# EAGLE design Circuit Diagram (EAGLE 9.3.0)
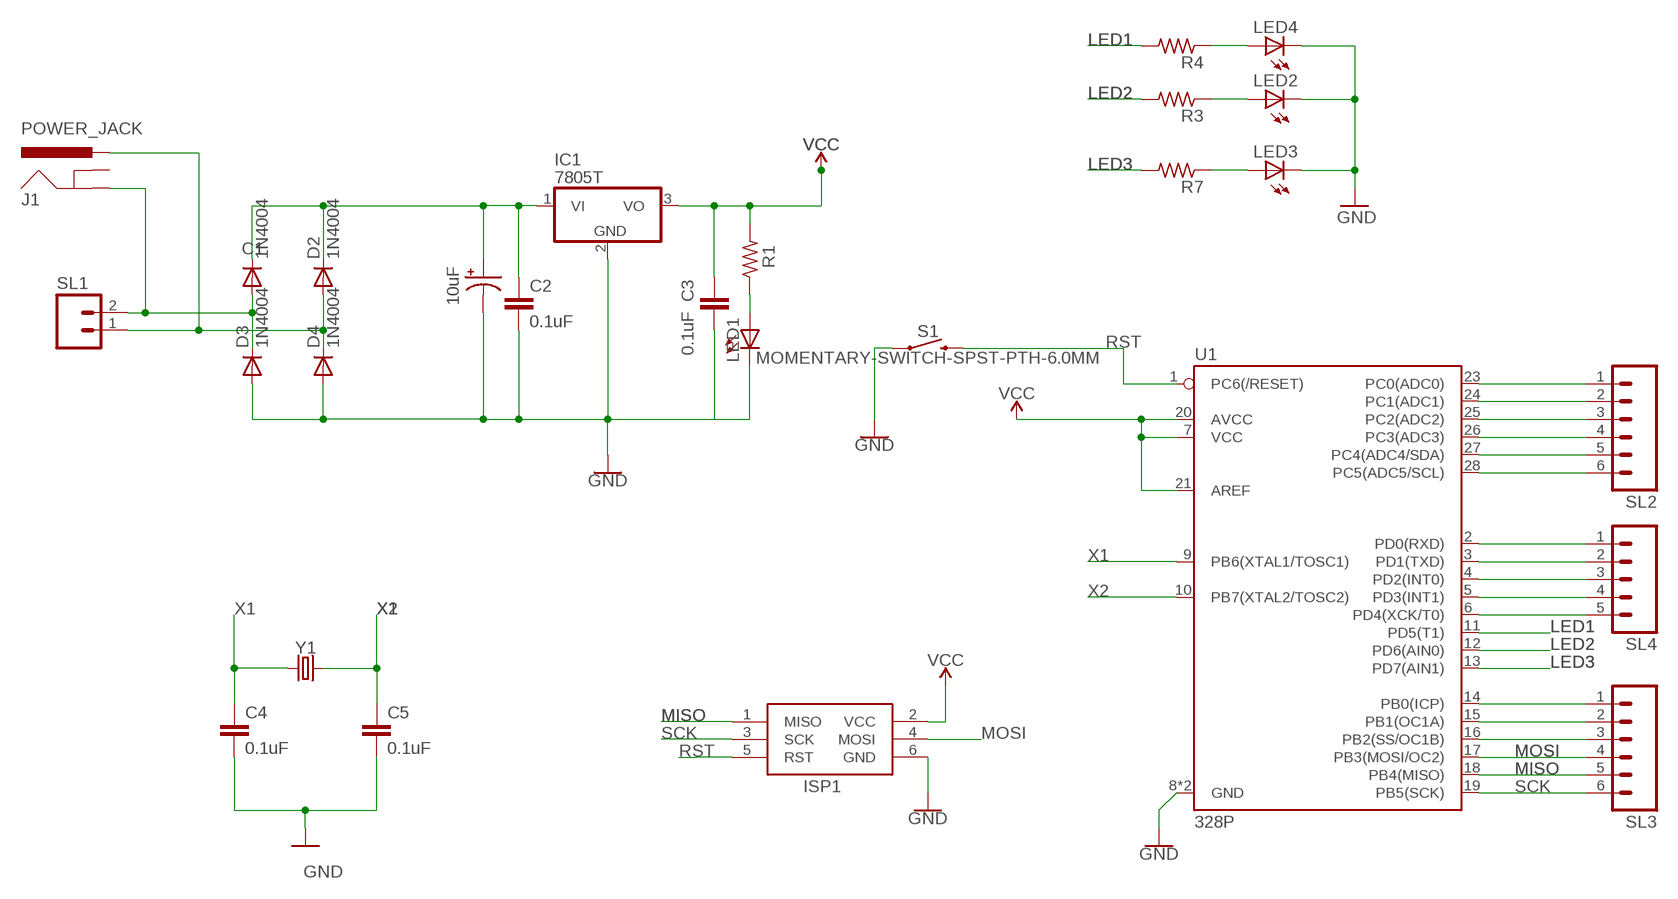
[diagram p0: schematic, sheet 1]

## Parts
C1  10uF  10UF-POLAR-RADIAL-2.5MM-25V-20%  [CPOL-RADIAL-2.5MM-5MM]
C2  0.1uF  0.1UF-KIT-EZ-50V-20%  [CAP-PTH-SMALL-KIT]
C3  0.1uF  0.1UF-KIT-EZ-50V-20%  [CAP-PTH-SMALL-KIT]
C4  0.1uF  0.1UF-KIT-EZ-50V-20%  [CAP-PTH-SMALL-KIT]
C5  0.1uF  0.1UF-KIT-EZ-50V-20%  [CAP-PTH-SMALL-KIT]
D1  1N4004  [DO41-10]
D2  1N4004  [DO41-10]
D3  1N4004  [DO41-10]
D4  1N4004  [DO41-10]
IC1  7805T  [TO220H]
ISP1  AVRISP-6  [AVRISP]
J1  POWER_JACK  [POWER_JACK_PTH]
LED1  LED3MM  [LED3MM]
LED2  LED3MM  [LED3MM]
LED3  LED3MM  [LED3MM]
LED4  LED3MM  [LED3MM]
R1  R-US_0207/9  [0207/9]
R3  R-US_0207/9  [0207/9]
R4  R-US_0207/9  [0207/9]
R7  R-US_0207/9  [0207/9]
S1  MOMENTARY-SWITCH-SPST-PTH-6.0MM  [TACTILE_SWITCH_PTH_6.0MM]
SL1  M02  [02P]
SL2  M06  [06P]
SL3  M06  [06P]
SL4  M05  [05P]
U1  328P  ATMEGA328P_PDIP  [DIP28]
Y1  CRYSTALPTH-HC49US  [HC49US]

## Nets
GND: C1.2(-) C2.2 C3.2 C4.2 C5.2 D3.A D4.A IC1.2(GND) ISP1.6(GND) LED1.K(C) LED2.K(C) LED3.K(C) LED4.K(C) S1.1 U1.8(GND) U1.22(GND)
LED1: R4.2 U1.11(PD5(T1))
LED2: R3.2 U1.12(PD6(AIN0))
LED3: R7.2 U1.13(PD7(AIN1))
MISO: ISP1.1(MISO) SL3.5 U1.18(PB4(MISO))
MOSI: ISP1.4(MOSI) SL3.4 U1.17(PB3(MOSI/OC2))
N$1: LED4.A R4.1
N$2: C1.1(+) C2.1 D1.C D2.C IC1.1(VI)
N$3: D1.A D3.C J1.GND SL1.2
N$4: SL2.1 U1.23(PC0(ADC0))
N$5: D2.A D4.C J1.PWR SL1.1
N$6: SL2.2 U1.24(PC1(ADC1))
N$7: LED1.A R1.1
N$8: SL2.3 U1.25(PC2(ADC2))
N$9: SL2.4 U1.26(PC3(ADC3))
N$10: SL2.5 U1.27(PC4(ADC4/SDA))
N$11: SL2.6 U1.28(PC5(ADC5/SCL))
N$12: SL4.1 U1.2(PD0(RXD))
N$13: SL4.2 U1.3(PD1(TXD))
N$14: SL4.3 U1.4(PD2(INT0))
N$15: SL4.4 U1.5(PD3(INT1))
N$16: SL4.5 U1.6(PD4(XCK/T0))
N$17: LED2.A R3.1
N$18: LED3.A R7.1
N$20: SL3.1 U1.14(PB0(ICP))
N$21: SL3.2 U1.15(PB1(OC1A))
N$22: SL3.3 U1.16(PB2(SS/OC1B))
RST: ISP1.5(RST) S1.3 U1.1(PC6(/RESET))
SCK: ISP1.3(SCK) SL3.6 U1.19(PB5(SCK))
VCC: C3.1 IC1.3(VO) ISP1.2(VCC) R1.2 U1.7(VCC) U1.20(AVCC) U1.21(AREF)
X1: C4.1 U1.9(PB6(XTAL1/TOSC1)) Y1.1
X2: C5.1 U1.10(PB7(XTAL2/TOSC2)) Y1.2
Unconnected: J1.GNDBREAK

## Library data of the parts
C1 = SparkFun-Capacitors:10UF-POLAR: 10.0µF polarized capacitors A capacitor is a passive two-terminal electrical component used to store electrical energy temporarily in an electric field.; PROD_ID: CAP-08440
C2-C5 = SparkFun-Capacitors:0.1UF: 0.1µF ceramic capacitors A capacitor is a passive two-terminal electrical component used to store electrical energy temporarily in an electric field.; PROD_ID: CAP-08370
D1-D4 = adafruit:1N4004: DIODE General purpose 1N400x type rectifier (With bigger pads) http://www.ladyada.net/library/pcb/eaglelibrary.html
IC1 = adafruit:78*: Positive VOLTAGE REGULATOR Added bigger pads to the TO-92 package
ISP1 = adafruit:AVRISP: AVR ISP HEADER Standard 6 pin header for AVR programming
J1 = SparkFun-Connectors:POWER_JACK: Power Jack Connector This is the standard 5.5mm barrel jack for power. The PTH is the most common, proven, reliable, footprint. The Slot footprint only works if the mill layer is transmitted to the PCB fab house so be warned. Here are the connectors we sell at SparkFun: DC Barrel Power Jack/Connector <https://www.sparkfun.com/products/119> (PRT-00119) DC Barrel Power Jack/Connector (SMD) <https://www.sparkfun.com/products/12748> (PRT-12748) DC Barrel Jack Adapter - Breadboard Compatible <https://www.sparkfun.com/products/10811> (PRT-10811) It is used on this SparkFun product (and many, many others): SparkFun RedBoard - Programmed with Arduino <https://www.sparkfun.com/products/12757> (DEV-12757) Also, if you need a mating power supply or connector, please check these out: Wall Adapter Power Supply - 9VDC 650mA <https://www.sparkfun.com/products/298> (TOL-00298) DC Barrel Jack Adapter - Male <https://www.sparkfun.com/products/10287> (PRT-10287); PROD_ID: CONN-08197
LED1-LED4 = adafruit:LED: LED OSRAM: - CHIPLED LG R971, LG N971, LY N971, LG Q971, LY Q971, LO R971, LY R971 LH N974, LH R974 LS Q976, LO Q976, LY Q976 LO Q996 - Hyper CHIPLED LW Q18S LB Q993, LB Q99A, LB R99A - SideLED LS A670, LO A670, LY A670, LG A670, LP A670 LB A673, LV A673, LT A673, LW A673 LH A674 LY A675 LS A676, LA A676, LO A676, LY A676, LW A676 LS A679, LY A679, LG A679 - Hyper Micro SIDELED® LS Y876, LA Y876, LO Y876, LY Y876 LT Y87S - SmartLED LW L88C, LW L88S LB L89C, LB L89S, LG L890 LS L89K, LO L89K, LY L89K LS L896, LA L896, LO L896, LY L896 - TOPLED LS T670, LO T670, LY T670, LG T670, LP T670 LSG T670, LSP T670, LSY T670, LOP T670, LYG T670 LG T671, LOG T671, LSG T671 LB T673, LV T673, LT T673, LW T673 LH T674 LS T676, LA T676, LO T676, LY T676, LB T676, LH T676, LSB T676, LW T676 LB T67C, LV T67C, LT T67C, LS T67K, LO T67K, LY T67K, LW E67C LS E67B, LA E67B, LO E67B, LY E67B, LB E67C, LV E67C, LT E67C LW T67C LS T679, LY T679, LG T679 LS T770, LO T770, LY T770, LG T770, LP T770 LB T773, LV T773, LT T773, LW T773 LH T774 LS E675, LA E675, LY E675, LS T675 LS T776, LA T776, LO T776, LY T776, LB T776 LHGB T686 LT T68C, LB T68C - Hyper Mini TOPLED® LB M676 - Mini TOPLED Santana® LG M470 LS M47K, LO M47K, LY M47K Source: http://www.osram.convergy.de/
R1 R3 R4 R7 = adafruit:R-US_: RESISTOR, American symbol
S1 = SparkFun-Switches:MOMENTARY-SWITCH-SPST: Momentary Switch (Pushbutton) - SPST Normally-open (NO) SPST momentary switches (buttons, pushbuttons). Variants PTH-12MM - 12mm square, through-hole Momentary Pushbutton Switch - 12mm Square <https://www.sparkfun.com/products/9190> (COM-09190) PTH-6.0MM, PTH-6.0MM-KIT - 6.0mm square, through-hole Mini Pushbutton Switch <https://www.sparkfun.com/products/97> (COM-00097) KIT package intended for soldering kit's - only one side of pads' copper is exposed. PTH-RIGHT-ANGLE-KIT - Right-angle, through-hole Right Angle Tactile Button <https://www.sparkfun.com/products/10791> - Used on SparkFun BigTime Watch Kit <https://www.sparkfun.com/products/11734> SMD-12MM - 12mm square, surface-mount Tactile Button - SMD (12mm) <https://www.sparkfun.com/products/12993> (COM-12993) Used on SparkFun PicoBoard <https://www.sparkfun.com/products/11888> SMD-4.5MM - 4.5mm Square Trackball Switch Used on SparkFun Blackberry Trackballer Breakout <https://www.sparkfun.com/products/13169> SMD-4.6MMX2.8MM - 4.60mm x 2.80mm, surface mount Used on SparkFun SAMD21 Mini Breakout <https://www.sparkfun.com/products/13664> SMD-5.2MM, SMD-5.2-REDUNDANT - 5.2mm square, surface-mount Mini Pushbutton Switch - SMD <https://www.sparkfun.com/products/8720> (COM-08720) Used on Arduino Pro Mini <https://www.sparkfun.com/products/11114> REDUNDANT package connects both switch circuits together SMD-6.0X3.5MM - 6.0 x 3.5mm, surface mount Momentary Reset Switch SMD <https://www.sparkfun.com/products/8229> (COM-08229) SMD-6.2MM-TALL - 6.2mm square, surface mount Tactile Button - SMD (6mm) <https://www.sparkfun.com/products/12992> Used on SparkFun Digital Sandbox <https://www.sparkfun.com/products/12651> SMD-RIGHT-ANGLE - Right-angle, surface mount Used on SparkFun Block for Intel® Edison - Arduino <https://www.sparkfun.com/products/13036>; PROD_ID: SWCH-08441; SF_SKU: COM-00097
SL1 = con-amp-quick:M02: AMP QUICK CONNECTOR; OC_FARNELL: unknown; OC_NEWARK: unknown
SL2 SL3 = con-amp-quick:M06: AMP QUICK CONNECTOR; OC_FARNELL: unknown; OC_NEWARK: unknown
SL4 = con-amp-quick:M05: AMP QUICK CONNECTOR; OC_FARNELL: unknown; OC_NEWARK: unknown
U1 = SparkFun-IC-Microcontroller:ATMEGA328P_PDIP: Atmel 328P Through hole ATMEGA328P uC used in the Arduino 32kb flash, 1k EEPROM, 2k SRAM Datasheet <http://www.sparkfun.com/datasheets/Components/SMD/ATMega328.pdf> SparkFun Products Storefront component: AVR 28 Pin 20MHz 32K 6A/D - ATMega328P <https://www.sparkfun.com/products/9061> (COM-09061) SparkFun Simon Says - Through-Hole Soldering Kit <https://www.sparkfun.com/products/10547> (KIT-10547) SparkFun Learn to Solder - Simon Says <https://www.sparkfun.com/products/13708> (KIT-13708) SparkFun BigTime Watch Kit <https://www.sparkfun.com/products/11734> (KIT-11734) SparkFun ClockIt <https://www.sparkfun.com/products/10930> (KIT-10930) SparkFun Serial Enabled LCD Kit <https://www.sparkfun.com/products/10097> (LCD-10097) SparkFun Simon Tilts - Through Hole Soldering Kit <https://www.sparkfun.com/products/12634> (KIT-12634) SparkFun Frequency Counter Kit <https://www.sparkfun.com/products/10140> (KIT-10140) FabFM Radio Kit <https://www.sparkfun.com/products/11043> (KIT-11043) SparkFun Binary Blaster Kit <https://www.sparkfun.com/products/12037> (KIT-12037) SparkFun Metro-Gnome <https://www.sparkfun.com/products/9236> (KIT-09236) ATmega328 with Arduino Optiboot (Uno) <https://www.sparkfun.com/products/10524> (DEV-10524); PROD_ID: IC-09136
Y1 = SparkFun-Clocks:CRYSTAL: Crystals (Generic) These are passive quartz crystals, which can be used as a clock source for a microcontroller. Crystal's are two-terminal devices. They require external "load" capacitors to generate an oscillating signal.

## Board
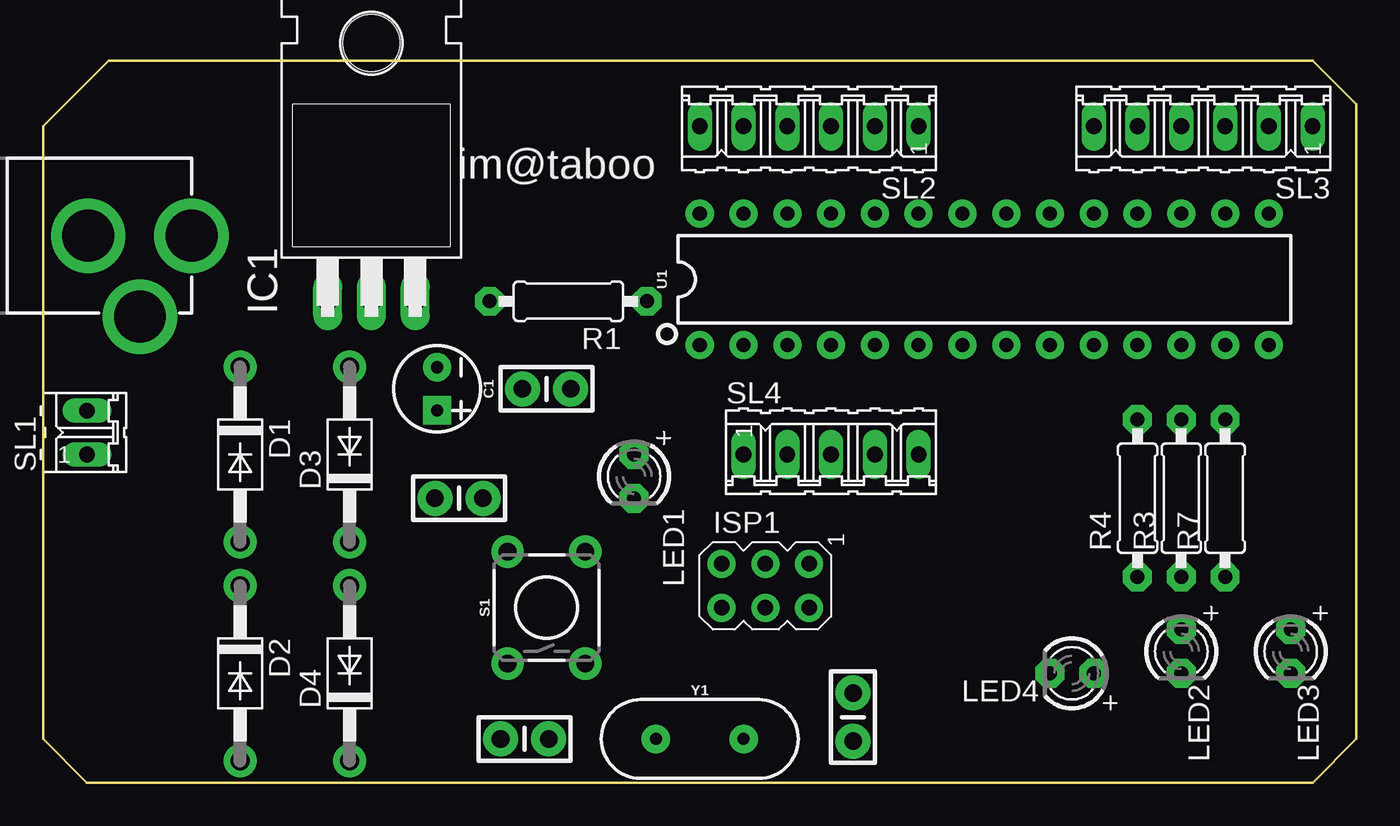
[diagram p1: board, top side]
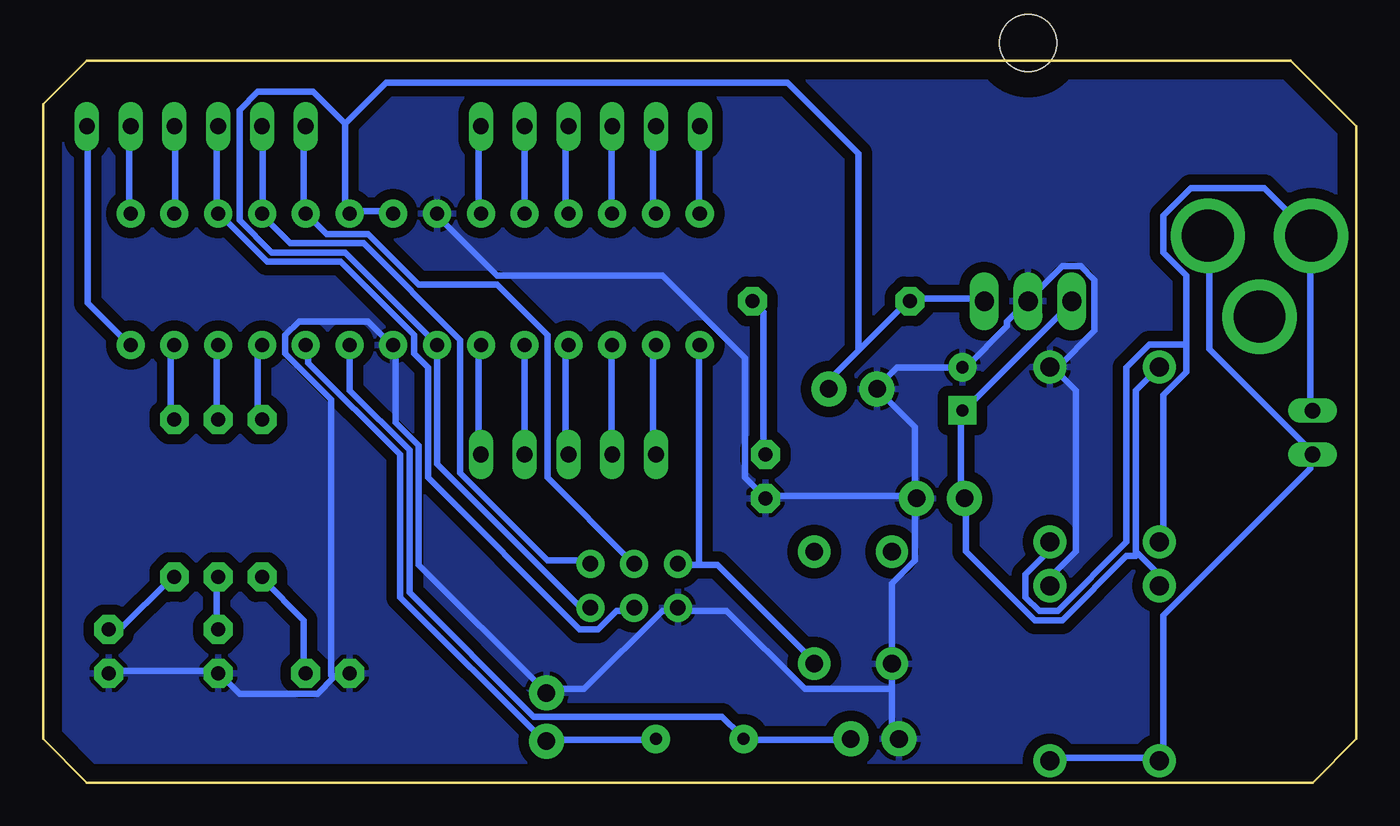
[diagram p2: board, bottom side, seen from below]

Size 76.2 x 41.91 mm. Coordinates in mm from the lower left corner, seen from the top.
Outline: 0,38.1 0,2.54 2.54,0 73.66,0 76.2,2.54 76.2,39.37 73.66,41.91 3.81,41.91 0,38.1
Copper layers (1*16): Top 0.035mm / dielectric 1.5mm / Bottom 0.035mm
Design rules "default *": minimum track width 15mil, minimum drill 0.35mm, track to track 6mil, track to pad 6mil, pad to pad 6mil, via to via 6mil, smd to smd 6mil, copper to edge 40mil, drill to drill 6mil, minimum pad ring 10mil, minimum via ring 8mil, stop-mask expansion 4mil, vias tented up to drill 0mil, thermal gap 10mil

### Footprints (pad centres in the part's own frame; a part is rotated, then mirrored left to right if it is on the bottom)
CPOL-RADIAL-2.5MM-5MM = drill 0.7 pad 1.651 square: 1 1.25,0 | drill 0.7 pad 1.651: 2 -1.25,0
CAP-PTH-SMALL-KIT = drill 1.016 pad 2.032: 1 -1.397,0; 2 1.397,0
DO41-10 = drill 1.118 pad 1.93: A 5.08,0; C -5.08,0
TO220H = drill 1.118 long: 1 -2.54,-10.16; 2 0,-10.16; 3 2.54,-10.16 | hole 3.302: 0,4.826
AVRISP = drill 0.9 pad 1.626: 1 -1.27,2.54; 2 1.27,2.54; 3 -1.27,0; 4 1.27,0; 5 -1.27,-2.54; 6 1.27,-2.54
POWER_JACK_PTH = drill 2.997 pad 4.318: GND 0,7.7; GNDBREAK 4.7,10.7; PWR 0,13.7
LED3MM = drill 0.813 pad 1.676 octagon: A -1.27,0; K 1.27,0
0207/9 = drill 0.813 pad 1.676 octagon: 1 -4.572,0; 2 4.572,0
TACTILE_SWITCH_PTH_6.0MM = drill 1.016 pad 1.88: 1 -3.251,2.261; 2 3.251,2.261; 3 -3.251,-2.261; 4 3.251,-2.261
02P = drill 0.914 long: 1 -1.27,0; 2 1.27,0
06P = drill 0.914 long: 1 -6.35,0; 2 -3.81,0; 3 -1.27,0; 4 1.27,0; 5 3.81,0; 6 6.35,0
05P = drill 0.914 long: 1 -5.08,0; 2 -2.54,0; 3 0,0; 4 2.54,0; 5 5.08,0
DIP28 = drill 0.813 pad 1.626: 1 -16.51,-3.81; 2 -13.97,-3.81; 3 -11.43,-3.81; 4 -8.89,-3.81; 5 -6.35,-3.81; 6 -3.81,-3.81; 7 -1.27,-3.81; 8 1.27,-3.81; 9 3.81,-3.81; 10 6.35,-3.81; 11 8.89,-3.81; 12 11.43,-3.81; 13 13.97,-3.81; 14 16.51,-3.81; 15 16.51,3.81; 16 13.97,3.81; 17 11.43,3.81; 18 8.89,3.81; 19 6.35,3.81; 20 3.81,3.81; 21 1.27,3.81; 22 -1.27,3.81; 23 -3.81,3.81; 24 -6.35,3.81; 25 -8.89,3.81; 26 -11.43,3.81; 27 -13.97,3.81; 28 -16.51,3.81
HC49US = drill 0.7 pad 1.651: 1 -2.54,0; 2 2.54,0

### Placement (x,y rotation side)
C1  22.86,22.86 270 top
C2  24.13,16.51 0 top
C3  29.21,22.86 180 top
C4  27.94,2.54 180 top
C5  46.99,3.81 90 top
D1  11.43,19.05 270 top
D2  11.43,6.35 270 top
D3  17.78,19.05 90 top
D4  17.78,6.35 90 top
IC1  19.05,38.1 0 top
ISP1  41.91,11.43 270 top
J1  -5.08,31.75 270 top
LED1  34.29,17.78 270 top
LED2  66.04,7.62 270 top
LED3  72.39,7.62 270 top
LED4  59.69,6.35 180 top
R1  30.48,27.94 180 top
R3  66.04,16.51 90 top
R4  63.5,16.51 90 top
R7  68.58,16.51 90 top
S1  29.21,10.16 90 top
SL1  2.54,20.32 90 top
SL2  44.45,38.1 180 top
SL3  67.31,38.1 180 top
SL4  45.72,19.05 0 top
U1  54.61,29.21 0 top
Y1  38.1,2.54 0 top

### Tracks (layer width: path | path; a pad name or v marks a point on that pad's centre or on a via)
GND
  Bottom 0.381: 59.34,6.1 60.27,5.17 64.81,5.17 65.88,6.24 LED2.K 66.14,6.5 72.28,6.5 LED3.K | 59.34,6.1 59.21,6.24 58.67,6.24 LED4.K | 59.34,6.1 59.47,6.24 59.47,22.24 62.14,24.91 62.14,25.97 61.34,26.77 57.34,26.77 56.01,25.44 U1.8 55.74,25.17 55.74,20.9 54.41,19.57 54.41,12.64 47.21,5.44 C5.2 46.94,5.44 44.81,5.44 40.27,9.97 39.47,9.97 ISP1.6 39.2,9.97 36.54,9.97 32,5.44 26.94,5.44 | U1.22 53.34,32.91 49.87,29.44 40.27,29.44 35.47,24.64 35.47,17.7 34.4,16.64 LED1.K 34.14,16.64 25.6,16.64 | D4.A 17.6,11.57 17.6,12.1 16.27,13.44 16.27,22.77 17.6,24.11 D3.A 17.34,24.11 15.2,26.24 15.2,29.17 16,29.97 17.07,29.97 18.94,28.1 IC1.2 19.2,27.84 20.27,26.77 20.27,26.51 22.67,24.11 C1.2 22.94,24.11 26.67,24.11 27.74,23.04 C3.2 27.74,22.77 25.6,20.64 25.6,16.64 | 26.94,5.44 26.94,3.04 26.67,2.77 C4.2 | 26.94,5.44 26.94,6.77 S1.1 26.94,7.04 26.94,11.57 25.6,12.9 25.6,16.37 C2.2 25.6,16.64
  pour Bottom (isolate 0.61): 3.81,41.91 0,38.1 0,2.54 2.54,0 73.66,0 76.2,2.54 76.2,39.37 73.66,41.91
  pour Bottom (isolate 0.61): 3.81,41.91 0,38.1 0,2.54 2.54,0 73.66,0 76.2,2.54 76.2,39.37 73.66,41.91
LED1
  Bottom 0.381: U1.11 63.74,25.17 63.74,21.17 R4.2
LED2
  Bottom 0.381: U1.12 66.14,25.17 66.14,21.17 R3.2
LED3
  Bottom 0.381: U1.13 68.81,25.17 68.81,21.17 R7.2
MISO
  Bottom 0.381: SL3.5 63.48,37.97 63.48,33.17 U1.18 63.48,32.91 61.87,31.3 57.61,31.3 52.01,25.71 52.01,17.97 46.94,12.9 44.54,12.9 ISP1.1
MOSI
  Bottom 0.381: SL3.4 66.14,37.97 66.14,33.17 U1.17 65.88,32.91 63.21,30.24 58.94,30.24 54.67,25.97 54.67,24.91 53.87,24.11 53.87,17.7 45.07,8.9 44.01,8.9 42.94,9.97 42.14,9.97 ISP1.4
N$1
  Bottom 0.381: LED4.A 61.07,6.5 61.07,9.44 63.48,11.84 R4.1
N$2
  Bottom 0.381: 12.67,13.3 12.8,13.44 12.8,22.77 11.47,24.11 D1.C | 12.67,13.3 11.47,12.1 11.47,11.57 D2.C | IC1.1 16.54,27.84 22.67,21.7 C1.1 22.94,21.44 22.94,16.64 C2.1 22.67,16.37 22.67,13.44 18.67,9.44 17.07,9.44 13.34,13.17 12.8,13.17 12.67,13.3
N$3
  Bottom 0.381: SL1.2 2.67,21.7 2.67,31.57 J1.GND 2.67,31.84 5.33,34.51 9.6,34.51 11.2,32.91 11.2,30.77 9.87,29.44 9.87,25.44 | 9.87,25.44 9.87,23.84 11.2,22.5 11.2,13.97 D1.A | 9.87,25.44 12,25.44 13.34,24.11 13.34,13.97 17.34,9.97 18.4,9.97 19.2,10.77 19.2,12.1 17.87,13.44 17.87,13.97 D3.C
N$4
  Bottom 0.381: SL2.1 50.94,37.97 50.94,33.17 U1.23
N$5
  Bottom 0.381: D4.C 17.6,1.44 11.47,1.44 D2.A 11.2,1.44 11.2,9.7 2.67,18.24 2.67,19.04 SL1.1 2.67,19.3 8.53,25.17 8.53,31.57 J1.PWR
N$6
  Bottom 0.381: SL2.2 48.27,37.97 48.27,33.17 U1.24
N$7
  Bottom 0.381: LED1.A 34.4,19.3 34.4,27.3 34.94,27.84 R1.1
N$8
  Bottom 0.381: SL2.3 45.87,37.97 45.87,33.17 U1.25
N$9
  Bottom 0.381: SL2.4 43.2,37.97 43.2,33.17 U1.26
N$10
  Bottom 0.381: SL2.5 40.8,37.97 40.8,33.17 U1.27
N$11
  Bottom 0.381: SL2.6 38.14,37.97 38.14,33.17 U1.28
N$12
  Bottom 0.381: SL4.1 40.8,19.3 40.8,25.17 U1.2
N$13
  Bottom 0.381: SL4.2 43.2,19.3 43.2,25.17 U1.3
N$14
  Bottom 0.381: SL4.3 45.87,19.3 45.87,25.17 U1.4
N$15
  Bottom 0.381: SL4.4 48.27,19.3 48.27,25.17 U1.5
N$16
  Bottom 0.381: SL4.5 50.94,19.3 50.94,25.17 U1.6
N$17
  Bottom 0.381: LED2.A 66.14,8.9 66.14,11.84 R3.1
N$18
  Bottom 0.381: LED3.A 72.28,8.9 71.74,8.9 68.81,11.84 R7.1
N$20
  Bottom 0.381: SL3.1 73.61,37.97 73.61,27.84 71.21,25.44 U1.14
N$21
  Bottom 0.381: SL3.2 71.21,37.97 71.21,33.17 U1.15
N$22
  Bottom 0.381: SL3.3 68.54,37.97 68.54,33.17 U1.16
RST
  Bottom 0.381: 38.14,12.64 37.07,12.64 31.47,7.04 S1.3 | 38.14,12.64 39.2,12.64 ISP1.5 | 38.14,12.64 38.14,25.17 U1.1
SCK
  Bottom 0.381: SL3.6 61.07,37.97 61.07,33.17 U1.19 60.81,32.91 59.74,31.84 57.34,31.84 54.41,28.91 49.87,28.91 46.94,25.97 46.94,17.7 42.14,12.9 ISP1.3
VCC
  Bottom 0.381: ISP1.2 44.54,10.24 45.07,10.24 53.34,18.5 U1.7 53.34,25.44 58.67,30.77 62.94,30.77 64.81,32.64 64.81,39.04 63.74,40.11 60.54,40.11 58.67,38.24 | IC1.3 21.6,28.1 25.87,28.1 R1.2 26.14,27.84 28.89,25.08 | 28.89,25.08 30.4,23.57 30.4,23.04 C3.1 | 55.74,33.17 U1.21 56.01,33.17 58.41,33.17 U1.20 58.67,33.17 58.67,38.24 | 28.89,25.08 28.89,36.51 33.01,40.63 56.29,40.63 58.67,38.24
X1
  Bottom 0.381: U1.9 58.41,25.17 58.41,22.77 54.94,19.3 54.94,11.04 47.74,3.84 36.8,3.84 35.74,2.77 Y1.1 35.47,2.5 29.34,2.5 C4.1
X2
  Bottom 0.381: U1.10 60.81,25.17 60.81,24.37 55.47,19.04 55.47,10.77 47.21,2.5 C5.1 46.94,2.5 40.8,2.5 Y1.2

### Text on the board
tPlace: im@taboo